# EAGLE design T-11_Version_5 (EAGLE 7.1.0)
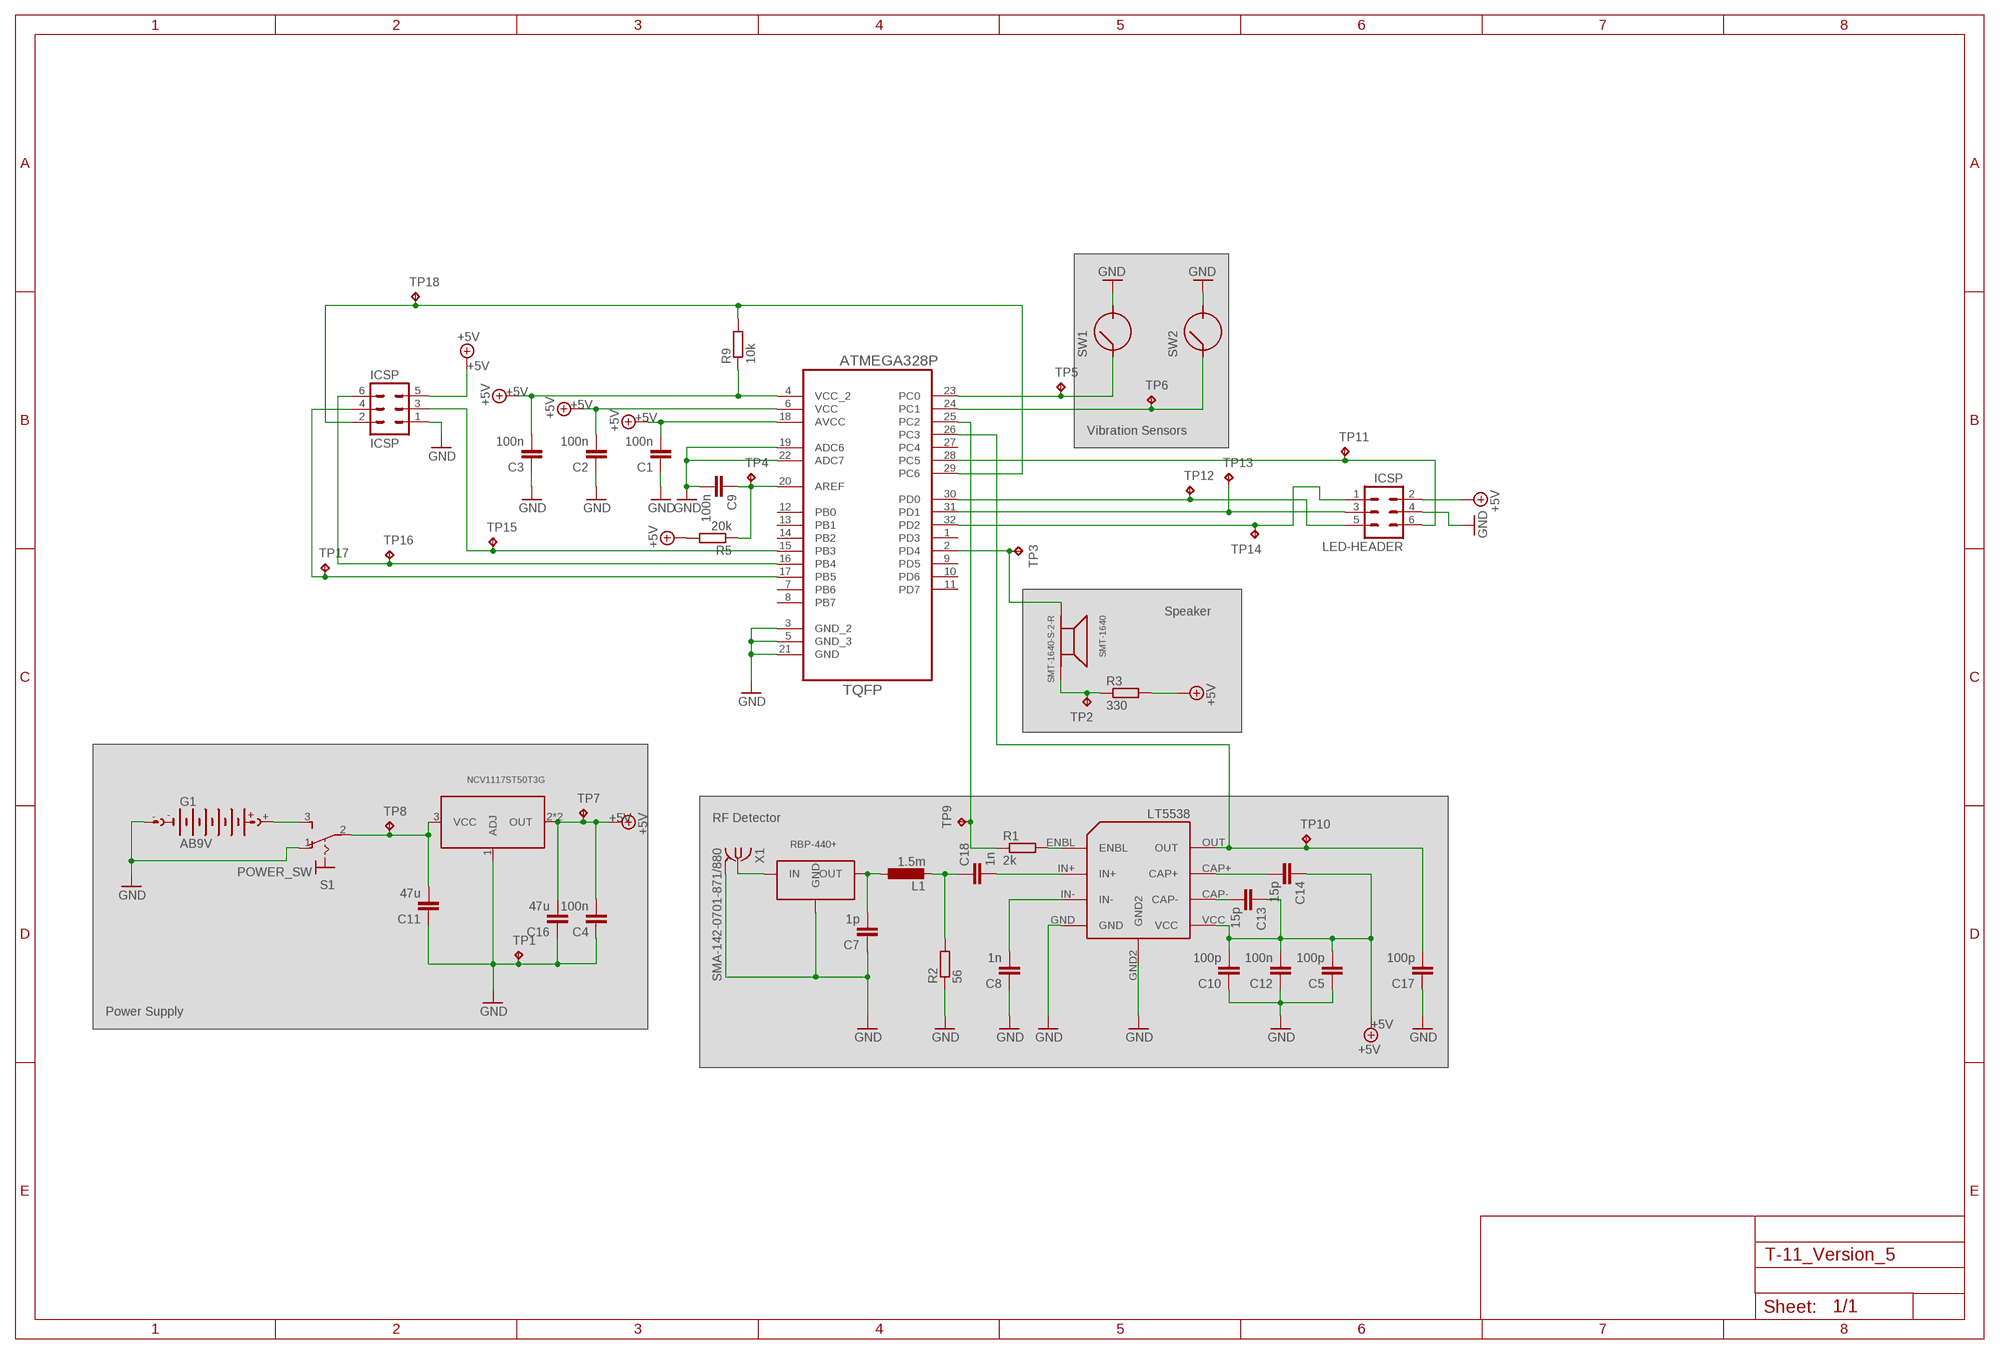
[diagram p0: schematic, sheet 1]

## Parts
C1  100n  C-EUC4532  [C4532]
C2  100n  C-EUC4532  [C4532]
C3  100n  C-EUC4532  [C4532]
C4  100n  C-EUC4532  [C4532]
C5  100p  C-EUC4532  [C4532]
C7  1p  C-EUC4532  [C4532]
C8  1n  C-EUC4532  [C4532]
C9  100n  C-EUC4532  [C4532]
C10  100p  C-EUC4532  [C4532]
C11  47u  C-EUC4532  [C4532]
C12  100n  C-EUC4532  [C4532]
C13  15p  C-EUC4532  [C4532]
C14  15p  C-EUC4532  [C4532]
C16  47u  C-EUC4532  [C4532]
C17  100p  C-EUC4532  [C4532]
C18  1n  C-EUC4532  [C4532]
G1  AB9V  [AB9V]
ICSP  ICSP  MA03-2  [MA03-2]
L1  1.5m  L-EUL4532P  [L4532P]
LED-HEADER  ICSP  MA03-2  [MA03-2]
LT5538  LT5538  [LT5538]
NVC1  NCV1117ST50T3G  [SOT223]
R1  2k  R-EU_R3225  [R3225]
R2  56  R-EU_R3225  [R3225]
R3  330  R-EU_R3225  [R3225]
R5  20k  R-EU_R3225  [R3225]
R9  10k  R-EU_R3225  [R3225]
RBP-440+  RBP-440+  [GP731]
S1  POWER_SW  320-916  [320-916]
SMT-1640  SMT-1640-S-2-R  [SMT-1640]
SW1  SW-1801X  [SW-1801X]
SW2  SW-1801X  [SW-1801X]
TP1  TPTP10R  [TP10R]
TP2  TPTP10R  [TP10R]
TP3  TPTP10R  [TP10R]
TP4  TPTP10R  [TP10R]
TP5  TPTP10R  [TP10R]
TP6  TPTP10R  [TP10R]
TP7  TPTP10R  [TP10R]
TP8  TPTP10R  [TP10R]
TP9  TPTP10R  [TP10R]
TP10  TPTP10R  [TP10R]
TP11  TPTP10R  [TP10R]
TP12  TPTP10R  [TP10R]
TP13  TPTP10R  [TP10R]
TP14  TPTP10R  [TP10R]
TP15  TPTP10R  [TP10R]
TP16  TPTP10R  [TP10R]
TP17  TPTP10R  [TP10R]
TP18  TPTP10R  [TP10R]
U1  ATMEGA328P-AU  [QFP80P900X900X120-32N]
X1  SMA-142-0701-871/880  [SMA-142-0701-871]

## Nets
+5V: C1.2 C2.2 C3.2 C4.2 C5.2 C10.2 C12.2 C13.1 C14.1 C16.2 ICSP.5 LED-HEADER.2 LT5538.VCC NVC1.2(OUT) NVC1.4(OUT) R3.2 R5.2 R9.1 TP7.TP U1.4(VCC_2) U1.6(VCC) U1.18(AVCC)
ANT_IN_1: C7.2 L1.1 RBP-440+.6(OUT)
ANT_IN_2: C18.1 L1.2 R2.2
GND: C1.1 C2.1 C3.1 C4.1 C5.1 C7.1 C8.1 C9.2 C10.1 C11.1 C12.1 C16.1 C17.1 G1.- ICSP.1 LED-HEADER.4 LT5538.GND LT5538.GND2 NVC1.1(ADJ) R2.1 RBP-440+.1(GND) RBP-440+.3(GND) RBP-440+.4(GND) RBP-440+.5(GND) RBP-440+.7(GND) RBP-440+.8(GND) S1.1(O) SW1.P$2 SW2.P$2 TP1.TP U1.3(GND_2) U1.5(GND_3) U1.19(ADC6) U1.21(GND) U1.22(ADC7) X1.2@1 X1.2@2 X1.2@3 X1.2@4
INDICATOR_1: LED-HEADER.1 TP14.TP U1.32(PD2)
INDICATOR_3: LED-HEADER.5 TP12.TP U1.30(PD0)
MISO: ICSP.6 TP16.TP U1.16(PB4)
MOSI: ICSP.3 TP15.TP U1.15(PB3)
N$1: LED-HEADER.6 TP11.TP U1.28(PC5)
N$2: RBP-440+.2(IN) X1.1
N$3: R3.1 SMT-1640.P$1(OUT) TP2.TP
N$4: G1.+ S1.3(S)
N$5: C18.2 LT5538.IN+
N$6: LT5538.ENBL R1.2
N$7: LED-HEADER.3 TP13.TP U1.31(PD1)
N$8: C14.2 LT5538.CAP+
N$9: C13.2 LT5538.CAP-
N$10: C9.1 R5.1 TP4.TP U1.20(AREF)
N$12: SMT-1640.P$2(IN) TP3.TP U1.2(PD4)
PS_VIN: C11.2 NVC1.3(VCC) S1.2(P) TP8.TP
RESET: ICSP.2 R9.2 TP18.TP U1.29(PC6)
RF_ENABLE: R1.1 TP9.TP U1.25(PC2)
RF_IN-: C8.2 LT5538.IN-
RF_OUT: C17.2 LT5538.OUT TP10.TP U1.26(PC3)
SCK: ICSP.4 TP17.TP U1.17(PB5)
VIB_1: SW2.P$1 TP6.TP U1.24(PC1)
VIB_2: SW1.P$1 TP5.TP U1.23(PC0)
Unconnected: U1.1(PD3) U1.7(PB6) U1.8(PB7) U1.9(PD5) U1.10(PD6) U1.11(PD7) U1.12(PB0) U1.13(PB1) U1.14(PB2) U1.27(PC4)

## Notes on the sheet
- Vibration Sensors
- Speaker
- RF Detector
- Power Supply

## Library data of the parts
C1-C5 C7-C14 C16-C18 = rcl:C-EU: CAPACITOR, European symbol
G1 = battery:AB9V: 9-V BATTERY CLIP
ICSP LED-HEADER = con-lstb:MA03-2: PIN HEADER; OC_FARNELL: unknown; OC_NEWARK: unknown
L1 = rcl:L-EU: INDUCTOR, European symbol
LT5538 = LT5538:LT5538
NVC1 = sym:NCV1117ST50T3G
R1-R3 R5 R9 = rcl:R-EU_: RESISTOR, European symbol
RBP-440+ = RBP:RBP-440+: Band Pass Filter 410 - 470 MHZ
S1 = switch:320-916: TOGGLE SWITCH distributor RS Components
SMT-1640 = SMT:SMT-1640-S-2-R: pizo buzzer
SW1 SW2 = SW18xxx:SW-1801X: Vibration Sensor
TP1-TP18 = testpad:TP: Test pad
U1 = Ava:ATMEGA328P-AU; DESCRIPTION: 8-bit Microcontroller with In-System Programmable Flash; MPN: ATMEGA328P-AU; OC_FARNELL: 1715486; OC_NEWARK: 14R4631; PACKAGE: TQFP-32; SUPPLIER: Atmel
X1 = con-coax:SMA-: SMA 50 Ohm End Launch Jack Receptacle - Round Contact Johnson Components Source: www.johnsoncomponents.com .. J502-ND.pdf; MF: JOHNSON COMPONENTS; MPN: 142-0701-871; OC_FARNELL: 1339835; OC_NEWARK: 91B6105

## Board
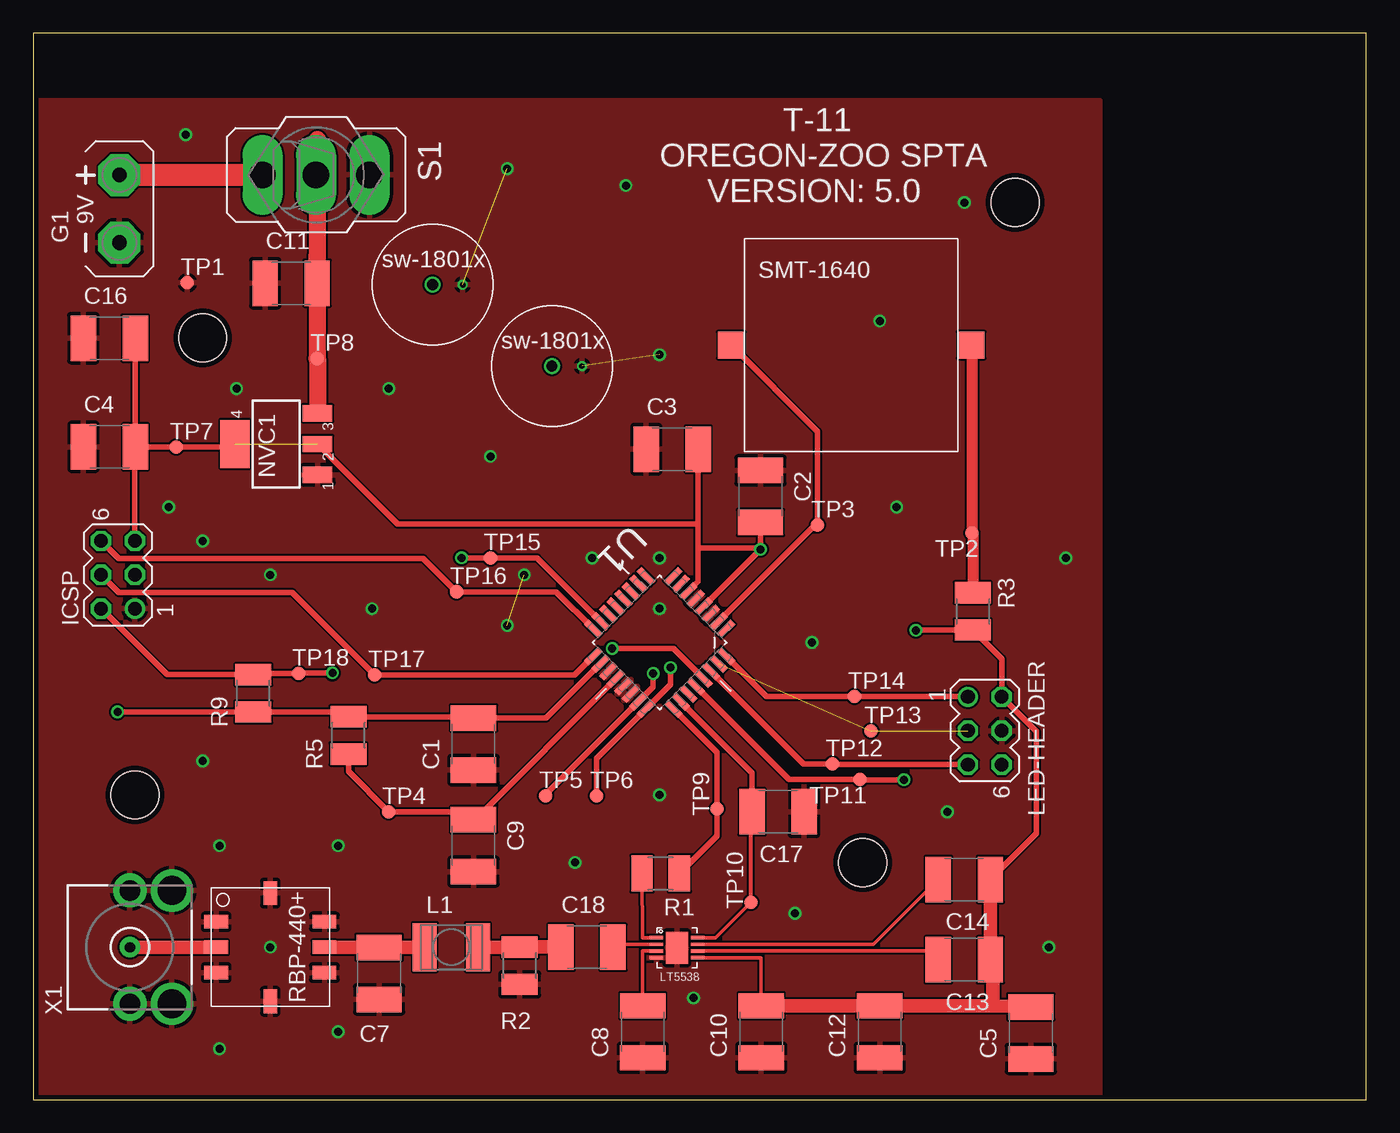
[diagram p1: board, top side]
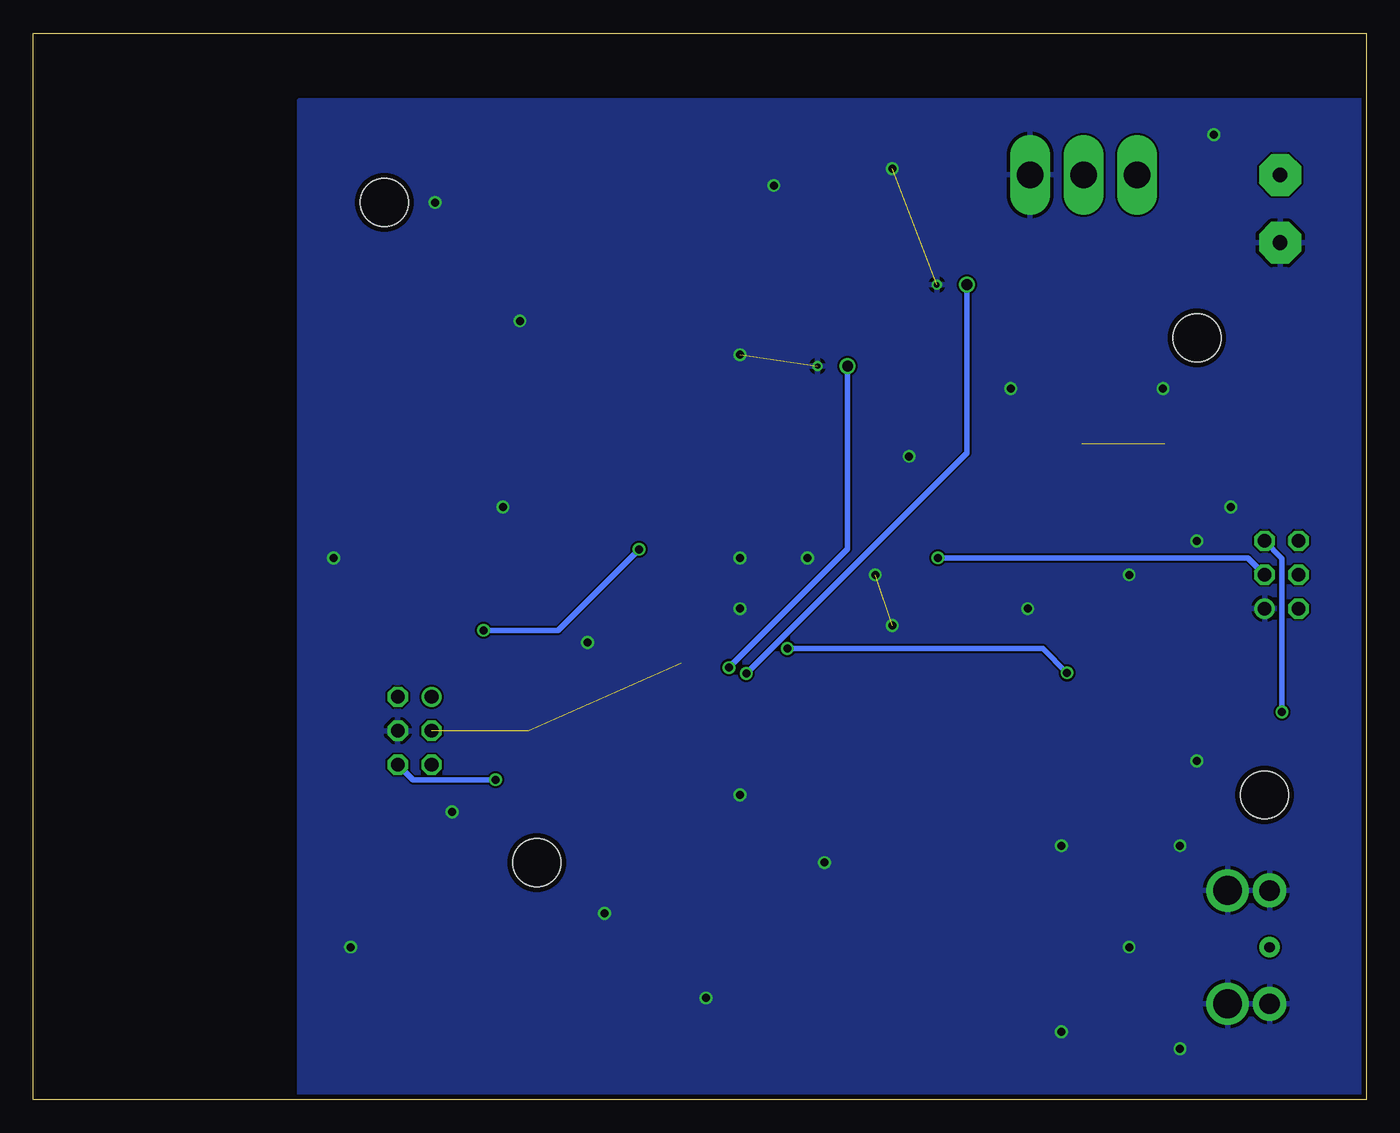
[diagram p2: board, bottom side, seen from below]

Size 100 x 80 mm. Coordinates in mm from the lower left corner, seen from the top.
Outline: 0,0 100,0 100,80 0,80 0,0
Copper layers (1*16): Top 0.0356mm / dielectric 1.5011mm / Bottom 0.0356mm
Design rules "OHS-Park": minimum track width 6mil, minimum drill 13mil, track to track 6mil, track to pad 6mil, pad to pad 6mil, via to via 6mil, smd to smd 6mil, copper to edge 15mil, drill to drill 6mil, minimum pad ring 7mil, minimum via ring 7mil, stop-mask expansion 3mil, vias tented up to drill 0mil, thermal gap 10mil
Holes 3.6 mm at 73.66,67.31 12.7,57.15 62.23,17.78 7.62,22.86

### Footprints (pad centres in the part's own frame; a part is rotated, then mirrored left to right if it is on the bottom)
C4532 = smd 1.9 x 3.4: 1 -1.95,0; 2 1.95,0
AB9V = drill 1.118 pad 3.15 octagon: + 0,2.54; - 0,-2.54
MA03-2 = drill 1.016: 1 -2.54,-1.27 | drill 1.016 octagon: 2 -2.54,1.27; 3 0,-1.27; 4 0,1.27; 5 2.54,-1.27; 6 2.54,1.27
L4532P = smd 1.8 x 3.6: 1 -2,0; 2 2,0
LT5538 = smd 0.25 x 1: CAP+ -0.22,1.58; CAP- 0.28,1.58; ENBL -0.72,-1.52; GND 0.78,-1.52; IN+ -0.22,-1.52; IN- 0.28,-1.52; OUT -0.72,1.58; VCC 0.78,1.58 | smd 2.38 x 1.65: GND2 0.05,0.025
SOT223 = smd 1.219 x 2.235: 1 -2.311,-3.099; 2 0,-3.099; 3 2.311,-3.099 | smd 3.6 x 2.2: 4 0,3.099
R3225 = smd 1.6 x 2.7: 1 -1.4,0; 2 1.4,0
GP731 = smd 1.016 x 1.778: 1 -1.905,-4.064; 2 0,-4.064; 3 1.905,-4.064; 5 1.905,4.064; 6 0,4.064; 7 -1.905,4.064 | smd 1.778 x 1.016: 4 4.064,0; 8 -4.064,0
320-916 = drill 2.007 long: 1 0,4.013; 2 0,0; 3 0,-4.013
SMT-1640 = smd 2 x 2: P$1 9,0; P$2 -9,0
SW-1801X = drill 0.8: P$1 0,0 | drill 0.406: P$2 2.25,0
TP10R = smd 1 x 1: TP 0,0
QFP80P900X900X120-32N = smd 1.473 x 0.508: 1 -4.242,2.794; 2 -4.242,2.007; 3 -4.242,1.194; 4 -4.242,0.406; 5 -4.242,-0.406; 6 -4.242,-1.194; 7 -4.242,-2.007; 8 -4.242,-2.794; 17 4.242,-2.794; 18 4.242,-2.007; 19 4.242,-1.194; 20 4.242,-0.406; 21 4.242,0.406; 22 4.242,1.194; 23 4.242,2.007; 24 4.242,2.794 | smd 0.508 x 1.473: 9 -2.794,-4.242; 10 -2.007,-4.242; 11 -1.194,-4.242; 12 -0.406,-4.242; 13 0.406,-4.242; 14 1.194,-4.242; 15 2.007,-4.242; 16 2.794,-4.242; 25 2.794,4.242; 26 2.007,4.242; 27 1.194,4.242; 28 0.406,4.242; 29 -0.406,4.242; 30 -1.194,4.242; 31 -2.007,4.242; 32 -2.794,4.242
SMA-142-0701-871 = drill 0.762 pad 1.524: 1 0,0 | drill 1.524 pad 2.54: 2@1 -4.255,0; 2@2 4.255,0 | drill 2.159 pad 2.794: 2@3 -4.255,-3.15; 2@4 4.255,-3.15

### Placement (x,y rotation side)
C1  33.02,26.67 90 top
C2  54.56,45.25 270 top
C3  47.93,48.8 0 top
C4  5.71,48.97 0 top
C5  74.84,5 90 top
C7  25.95,9.46 90 top
C8  45.72,5.08 90 top
C9  33.02,19.05 270 top
C10  54.61,5.08 90 top
C11  19.35,61.25 0 top
C12  63.5,5.08 90 top
C13  69.85,10.49 180 top
C14  69.85,16.51 180 top
C16  5.7,57.12 0 top
C17  55.88,21.59 180 top
C18  41.53,11.43 0 top
G1  6.46,66.83 0 top
ICSP  6.35,39.37 90 top
L1  31.37,11.43 0 top
LED-HEADER  71.39,27.67 270 top
LT5538  48.26,11.43 270 top
NVC1  18.22,49.18 90 top
R1  47.07,16.96 180 top
R2  36.49,10.04 90 top
R3  70.48,36.63 270 top
R5  23.64,27.32 90 top
R9  16.51,30.48 90 top
RBP-440+  17.78,11.43 270 top
S1  21.21,69.38 270 top
SMT-1640  61.37,56.61 0 top
SW1  29.96,61.14 0 top
SW2  38.91,55.03 0 top
TP1  11.55,61.29 0 top
TP2  70.43,42.51 180 top
TP3  58.85,43.09 0 top
TP4  26.67,21.59 0 top
TP5  38.44,22.79 0 top
TP6  42.26,22.78 0 top
TP7  10.73,48.94 0 top
TP8  21.29,55.6 0 top
TP9  51.3,21.79 90 top
TP10  53.84,14.8 90 top
TP11  62.03,24.01 180 top
TP12  59.94,25.18 0 top
TP13  62.84,27.65 0 top
TP14  61.61,30.24 0 top
TP15  34.29,40.64 0 top
TP16  31.75,38.1 0 top
TP17  25.62,31.87 0 top
TP18  19.9,31.97 0 top
U1  46.99,34.29 225 top
X1  7.25,11.43 90 top

### Tracks (layer width: path | path; a pad name or v marks a point on that pad's centre or on a via)
+5V  (via drill 0.6)  (1 unrouted)
  Top 0.254: LT5538.VCC 54.61,10.65 C10.2
  Top 0.406: U1.18 38.48,28.62 C1.2 32.92,28.72 R5.2 23.28,29.08 R9.1 v6.32,29.08 v6.31,29.07 | U1.6 49.88,38.87 49.88,41.39 | 49.88,41.39 49.88,43.18 | 49.88,43.18 C3.2 | U1.4 v54.56,41.28 | v54.56,41.28 C2.2 | NVC1.4 14.75,48.94 TP7.TP 10.7,48.97 C4.2 | C4.2 C16.2 | v54.56,41.28 54.45,41.39 49.88,41.39 | v66.21,35.21 66.23,35.23 R3.2 72.66,33.05 LED-HEADER.2 75.27,27.6 75.27,19.97 C14.1 | C4.2 7.62,48.93 ICSP.5 | NVC1.2 27.32,43.18 49.88,43.18
  Top 1.016: C10.2 C12.2 71.98,7.03 | 71.98,7.03 C5.2 | C14.1 C13.1 71.98,10.16 71.98,7.03
  Bottom 0.406: ICSP.5 6.31,40.6 v6.31,29.07 | v54.56,41.28 60.63,35.21 v66.21,35.21
ANT_IN_1
  Top 1.016: RBP-440+.6 25.93,11.43 C7.2 29.35,11.41 L1.1
ANT_IN_2
  Top 1.016: L1.2 R2.2 C18.1
GND  (via drill 0.6)  (3 unrouted)
  other vias: 11.43,72.39 35.56,69.85 44.45,68.58 69.85,67.31 64.77,44.45 63.5,58.42 77.47,40.64 34.29,48.26 26.67,53.34 15.24,53.34 10.16,44.45 17.78,39.37 25.4,36.83 35.56,35.56 36.83,39.37 41.91,40.64 46.99,40.64 58.42,34.29 68.58,21.59 57.15,13.97 76.2,11.43 22.86,19.05 12.7,25.4 13.97,19.05 17.78,11.43 13.97,3.81 22.86,5.08 40.64,17.78 46.99,22.86 49.53,7.62 46.99,55.88 12.7,41.91 46.99,36.83
  pour Top: 0,0 80.01,0 80.01,73.66 80.01,74.93 0,74.93
  pour Bottom: 0,0 80.01,0 80.01,74.93 0,74.93
INDICATOR_1
  Top 0.406: U1.32 55,30.24 TP14.TP 70.09,30.24 LED-HEADER.1
INDICATOR_3
  Top 0.406: U1.30 57.79,25.18 TP12.TP 59.99,25.13 LED-HEADER.5
MISO
  Top 0.406: U1.16 39.23,38.1 TP16.TP 29.26,40.59 6.4,40.59 ICSP.6
MOSI  (via drill 0.6)
  Top 0.406: U1.15 37.8,40.64 TP15.TP v32.14,40.64
  Bottom 0.406: v32.14,40.64 8.89,40.64 ICSP.3
N$1  (via drill 0.6)
  Top 0.406: U1.28 56.7,24.01 TP11.TP 62.04,24 v65.32,24
  Bottom 0.406: v65.32,24 71.52,24 LED-HEADER.6
N$2
  Top 1.016: X1.1 RBP-440+.2
N$3
  Top 0.813: SMT-1640.P$1 70.43,56.55 TP2.TP 70.48,42.47 R3.1
N$4
  Top 1.676: S1.3 G1.+
N$5
  Top 0.254: 43.18,11.65 43.18,11.43 C18.2 43.7,11.65 LT5538.IN+
N$6
  Top 0.254: LT5538.ENBL 45.72,12.15 R1.2
N$7  (2 unrouted)
N$8
  Top 0.254: LT5538.CAP+ 63.04,11.65 C14.2
N$9
  Top 0.254: LT5538.CAP- 67.9,11.15 C13.2
N$10
  Top 0.406: U1.20 33.12,21 C9.1 32.43,21.59 TP4.TP 23.64,24.62 R5.1
N$12
  Top 0.406: U1.2 58.63,43.09 TP3.TP 58.85,50.13 SMT-1640.P$2
PS_VIN
  Top 1.27: S1.2 21.3,72.03 C11.2 21.29,63.32 TP8.TP 21.32,55.58 NVC1.3
RESET  (via drill 0.6)
  Top 0.406: U1.29 48.01,33.84 v43.43,33.84 | v22.44,32.02 19.95,32.02 TP18.TP 16.6,31.97 R9.2 10.03,31.88 ICSP.2
  Bottom 0.406: v43.43,33.84 24.27,33.84 v22.44,32.02
RF_ENABLE
  Top 0.406: U1.25 51.3,26.03 TP9.TP 51.3,19.79 R1.1
RF_IN-
  Top 0.254: LT5538.IN- 45.72,11.15 C8.2
RF_OUT
  Top 0.254: LT5538.OUT 51.19,12.15 TP10.TP
  Top 0.305: TP10.TP 53.84,21.5
  Top 0.406: U1.26 53.93,24.51 C17.2
  Top 1.016: 53.84,21.5 C17.2
SCK
  Top 0.406: ICSP.4 6.39,38.05 19.43,38.05 TP17.TP 40.62,31.87 U1.17
VIB_1  (via drill 0.6)
  Top 0.406: TP6.TP 42.26,25.61 U1.24 47.81,31.16 v47.81,32.41
  Bottom 0.406: v47.81,32.41 38.91,41.31 SW2.P$1
VIB_2  (via drill 0.6)
  Top 0.406: TP5.TP 38.44,22.91 U1.23 46.51,30.97 v46.51,31.96
  Bottom 0.406: v46.51,31.96 29.96,48.51 SW1.P$1

### Text on the board
tNames: T-11 / OREGON-ZOO SPTA / VERSION: 5.0